# Altium schematic sheet Main.SchDoc
size A4
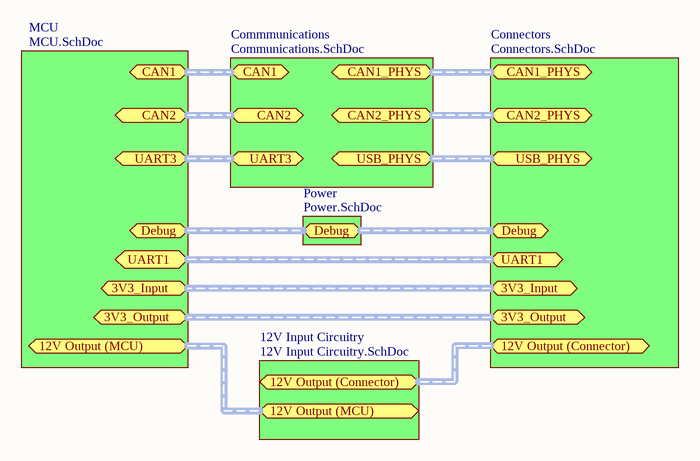
[diagram p0: Main.SchDoc]

## Sub-sheets
12V Input Circuitry = 12V Input Circuitry.SchDoc: no entries
Commmunications = Communications.SchDoc: no entries
Connectors = Connectors.SchDoc: no entries
MCU = MCU.SchDoc: no entries
Power = Power.SchDoc: no entries

## Ports
3V3_Input (harness IO), 3V3_Output (harness IO), 12V Output (Connector) (harness IO), 12V Output (MCU) (harness IO), CAN1 (harness CAN), CAN1_PHYS (harness CAN_PHYS), CAN2 (harness CAN), CAN2_PHYS (harness CAN_PHYS), Debug (harness Debug), UART1 (harness UART), UART3 (harness UART with Flow Control), USB_PHYS (harness USB_PHYS)